# EAGLE design Shield (EAGLE 7.7.0)
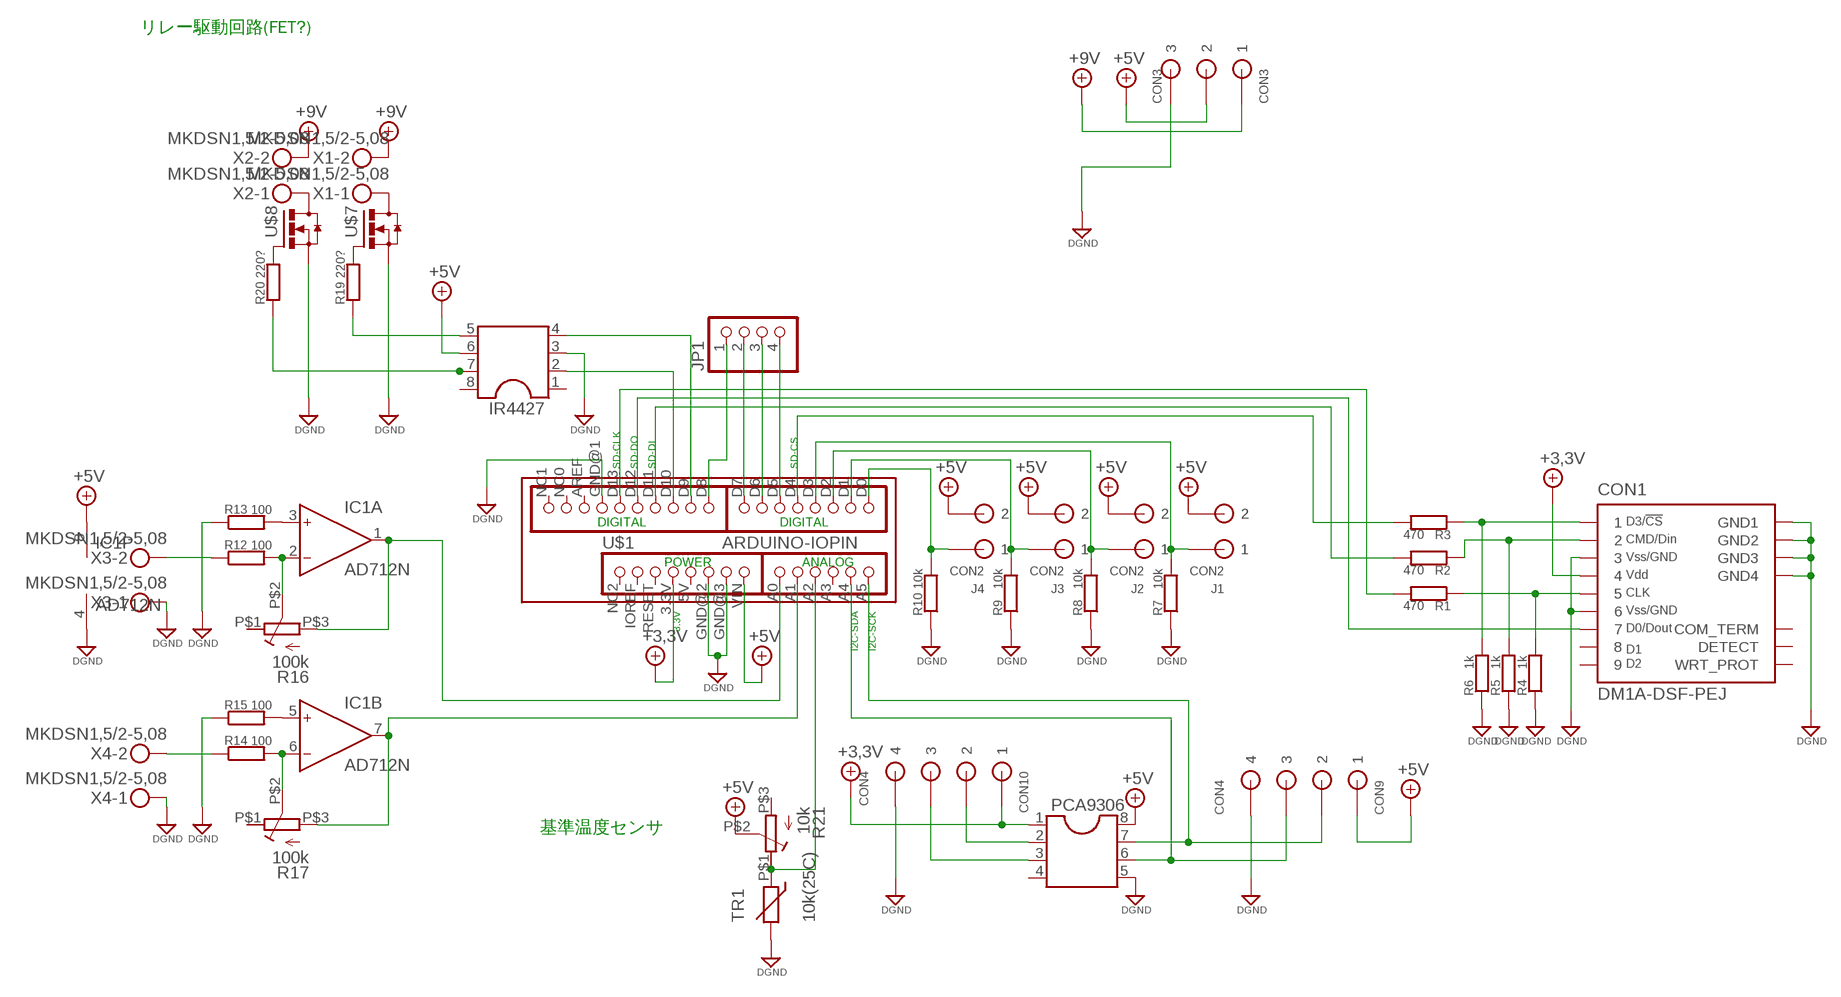
[diagram p0: schematic, sheet 1]

## Parts
CON1  DM1A-DSF-PEJ  [DM1A-DSF-PEJ]
CON3  CON3  [CON3]
CON9  CON4  [CON4]
CON10  CON4  [CON4]
IC1  AD712N  [DIL08]
IR4427  DIL8  [DIL08]
J1  CON2  [CON2]
J2  CON2  [CON2]
J3  CON2  [CON2]
J4  CON2  [CON2]
JP1  PINHD-1X4  [1X04]
PCA9306  DIL8S  [SOCKET-08]
R1  470  抵抗0207/7  [1/4W-H3_(0207/7)]
R2  470  抵抗0207/7  [1/4W-H3_(0207/7)]
R3  470  抵抗0207/7  [1/4W-H3_(0207/7)]
R4  1k  抵抗0207/7  [1/4W-H3_(0207/7)]
R5  1k  抵抗0207/7  [1/4W-H3_(0207/7)]
R6  1k  抵抗0207/7  [1/4W-H3_(0207/7)]
R7  10k  抵抗0207/7  [1/4W-H3_(0207/7)]
R8  10k  抵抗0207/7  [1/4W-H3_(0207/7)]
R9  10k  抵抗0207/7  [1/4W-H3_(0207/7)]
R10  10k  抵抗0207/10  [1/4W-H4_(0207/10)]
R12  100  抵抗0207/7  [1/4W-H3_(0207/7)]
R13  100  抵抗0207/7  [1/4W-H3_(0207/7)]
R14  100  抵抗0207/7  [1/4W-H3_(0207/7)]
R15  100  抵抗0207/7  [1/4W-H3_(0207/7)]
R16  100k  抵抗(可変)  [GF063PB]
R17  100k  抵抗(可変)  [GF063PB]
R19  220?  抵抗0207/7  [1/4W-H3_(0207/7)]
R20  220?  抵抗0207/7  [1/4W-H3_(0207/7)]
R21  10k  抵抗(可変)  [GF063PB]
TR1  10k(25C)  THERMISTOR_R-2,5  [RS-2,5]
U$1  ARDUINO-IOPIN  [ARDUINO-SHIELD-PIN-ONLY]
U$7  TO-220(MOS-FET_N)  [TO-220]
U$8  TO-220(MOS-FET_N)  [TO-220]
X1  MKDSN1,5/2-5,08  [MKDSN1,5/2-5,08]
X2  MKDSN1,5/2-5,08  [MKDSN1,5/2-5,08]
X3  MKDSN1,5/2-5,08  [MKDSN1,5/2-5,08]
X4  MKDSN1,5/2-5,08  [MKDSN1,5/2-5,08]

## Nets
+3.3V: CON1.4 CON10.P$1 PCA9306.1 U$1.3.3V(3,3V) ; supply symbol labelled +3,3V
+5V: CON3.P$2 CON9.P$1 IC1.8(P:V+) IR4427.6 J1.P$2 J2.P$2 J3.P$2 J4.P$2 PCA9306.8 R21.P$2(S) U$1.VIN
+9V: CON3.P$1 X1.2 X2.2
DGND: CON1.3 CON1.6 CON1.GND1 CON1.GND2 CON1.GND3 CON1.GND4 CON3.P$3 CON9.P$4 CON10.P$4 IC1.4(P:V-) IR4427.3 PCA9306.5 R4.1 R5.1 R6.1 R7.1 R8.1 R9.1 R10.1 R13.1 R15.1 TR1.2 U$1.GND@1(GND0) U$1.GND@2(GND1) U$1.GND@3(GND2) U$7.3(S) U$8.3(S) X3.1 X4.1
N$1: CON1.2 R2.1 R5.2
N$2: R1.2 U$1.D13
N$3: CON1.5 R1.1 R4.2
N$4: J1.P$1 R7.2 U$1.D3
N$5: R2.2 U$1.D11
N$6: CON1.1 R3.1 R6.2
N$7: R3.2 U$1.D4
N$8: J2.P$1 R8.2 U$1.D2
N$9: CON1.7 U$1.D12
N$10: J3.P$1 R9.2 U$1.D1
N$11: J4.P$1 R10.2 U$1.D0
N$12: CON10.P$2 PCA9306.2
N$13: CON9.P$3 PCA9306.6 U$1.A4
N$14: CON9.P$2 PCA9306.7 U$1.A5
N$15: CON10.P$3 PCA9306.3
N$16: IC1.2(A:IN-) R12.2 R16.P$2(S)
N$17: IC1.3(A:IN+) R13.2
N$18: IC1.5(B:IN+) R15.2
N$19: IC1.6(B:IN-) R14.2 R17.P$2(S)
N$20: IC1.1(A:OUT) R16.P$3(A) U$1.A0
N$21: IC1.7(B:OUT) R17.P$3(A) U$1.A1
N$22: JP1.4 U$1.D5
N$23: JP1.3 U$1.D6
N$24: JP1.2 U$1.D7
N$25: JP1.1 U$1.D8
N$26: U$7.2(D) X1.1
N$27: R19.2 U$7.1(G)
N$28: R21.P$1(E) TR1.1 U$1.A2
N$29: IR4427.2 U$1.D10
N$30: IR4427.4 U$1.D9
N$31: U$8.2(D) X2.1
N$32: R20.2 U$8.1(G)
N$33: IR4427.5 R19.1
N$34: IR4427.7 R20.1
N$35: R14.1 X4.2
N$36: R12.1 X3.2
Unconnected: CON1.8 CON1.9 CON1.COM_TERM CON1.DETECT CON1.WRT_PROT IR4427.1 IR4427.8 PCA9306.4 R16.P$1(E) R17.P$1(E) R21.P$3(A) U$1.5V U$1.A3 U$1.AREF U$1.IOREF U$1.NC0 U$1.NC1 U$1.NC2 U$1.RESET

## Notes on the sheet
- リレー駆動回路(FET?)
- SD-CLK | SD-DO | SD-DI | SD-CS
- 3.3V | I2C-SDA | I2C-SCK
- 基準温度センサ

## Library data of the parts
CON1 = (スロット)SDカード:DM1A-DSF-PEJ: HIROSE DM1A
CON3 = (コネクタ)XH:CON3: low insertion CON
CON9 CON10 = (コネクタ)XH:CON4: Low insertion connector 4pin
IC1 = analog-devices:AD712: Dual Precision, Low Cost, High Speed BiFET Op Amp Source: http://www.analog.com/static/imported-files/data_sheets/AD712.pdf; MF: ALTERA CORPORATION; MPN: AD712JNZ; OC_FARNELL: 9604898; OC_NEWARK: 59K4554
IR4427 PCA9306 = (半導体)汎用DIP:DIL8: Dual In Line / Socket
J1-J4 = (コネクタ)XH:CON2: low insertion CON
JP1 = (コネクタ)ピンヘッダ:PINHD-1X4: PIN HEADER
R1-R10 R12-R15 R19 R20 = (Foundation)抵抗:抵抗: RESISTOR, European symbol
R16 R17 R21 = (抵抗)可変抵抗:抵抗(可変): Trimm resistor
TR1 = discrete:THERMISTOR_: Thermo Resistor
U$1 = (モジュール)Arduino:ARDUINO-IOPIN
U$7 U$8 = (半導体)FET＆トランジスタ:TO-220(MOS-FET_N)
X1-X4 = con-phoenix-508:MKDSN1,5/2-5,08: MKDSN 1,5/ 2-5,08 Printklemme Nennstrom: 13,5 A Nennspannung: 250 V Rastermaß: 5,08 mm Polzahl: 2 Anschlussart: Schraubanschluss Montage: Löten Anschlussrichtung Leiter/Platine: 0 ° Artikelnummer: 1729128 Source: http://eshop.phoenixcontact.com .. 1729128.pdf

## Board
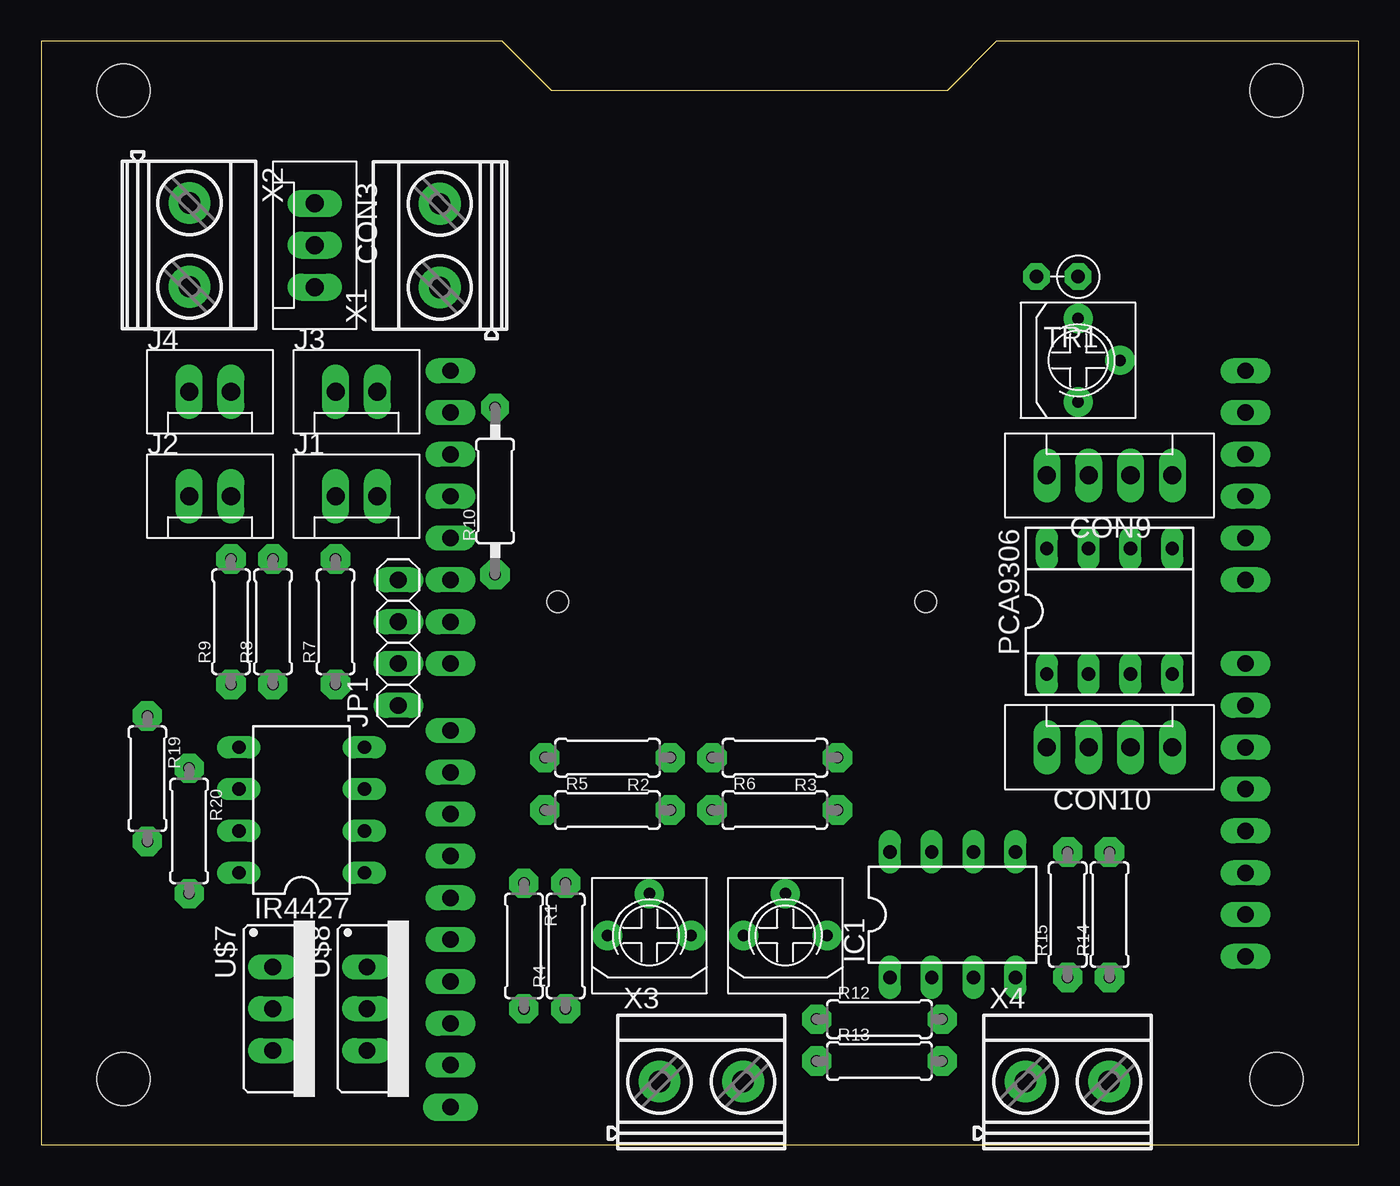
[diagram p1: board, top side]
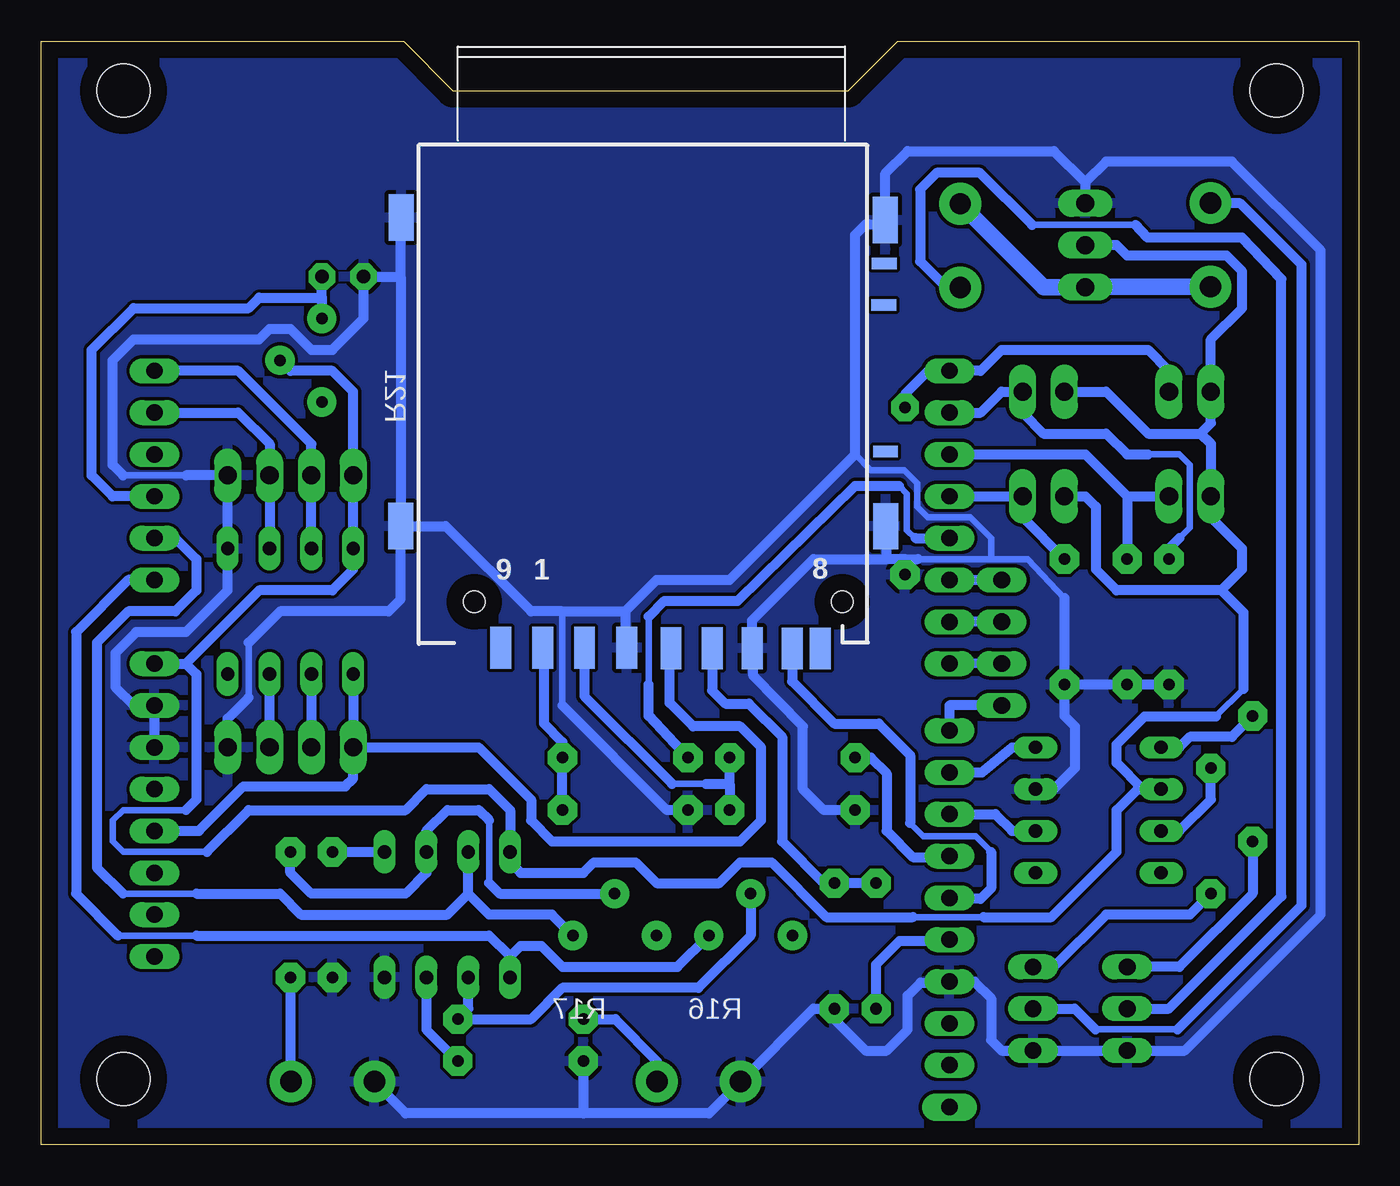
[diagram p2: board, bottom side, seen from below]

Size 80 x 67 mm. Coordinates in mm from the lower left corner, seen from the top.
Outline: 0,0 80,0 80,67 58,67 55,64 31,64 28,67 0,67 0,0
Copper layers (1*16): Top 0.035mm / dielectric 1.5mm / Bottom 0.035mm
Design rules "default": minimum track width 10mil, minimum drill 24mil, track to track 8mil, track to pad 8mil, pad to pad 8mil, via to via 8mil, smd to smd 8mil, copper to edge 40mil, drill to drill 8mil, minimum pad ring 10mil, minimum via ring 8mil, stop-mask expansion 4mil, vias tented up to drill 0mil, thermal gap 10mil
Holes 3.2 mm at 5,4 5,64 75,64 75,4

### Footprints (pad centres in the part's own frame; a part is rotated, then mirrored left to right if it is on the bottom)
DM1A-DSF-PEJ = smd 1.27 x 2.54: 1 6.263,16.809; 2 3.738,16.809; 3 1.161,16.813; 4 -1.516,16.84; 5 -4.016,16.84; 6 -6.44,16.84; 7 -8.865,16.866; 8 -10.565,16.866; 9 8.814,16.809 | smd 1.5 x 0.7: COM_TERM -14.462,-6.502; DETECT -14.532,4.902; WRT_PROT -14.437,-3.988 | smd 1.5 x 2.8: GND1 14.895,9.427; GND2 -14.549,9.452; GND3 -14.523,-9.152; GND4 14.859,-9.305 | hole 1.295: -11.913,14.021; 10.439,14.021
CON3 = drill 1.1 long: P$1 2.54,0; P$2 0,0; P$3 -2.54,0
CON4 = drill 1.1 long: P$1 3.81,0; P$2 1.27,0; P$3 -1.27,0; P$4 -3.81,0
DIL08 = drill 0.813 long: 1 -3.81,-3.81; 2 -1.27,-3.81; 3 1.27,-3.81; 4 3.81,-3.81; 5 3.81,3.81; 6 1.27,3.81; 7 -1.27,3.81; 8 -3.81,3.81
CON2 = drill 1.1 long: P$1 1.27,0; P$2 -1.27,0
1X04 = drill 1.016 long: 1 -3.81,0; 2 -1.27,0; 3 1.27,0; 4 3.81,0
SOCKET-08 = drill 0.813 long: 1 -3.81,-3.81; 2 -1.27,-3.81; 3 1.27,-3.81; 4 3.81,-3.81; 5 3.81,3.81; 6 1.27,3.81; 7 -1.27,3.81; 8 -3.81,3.81
1/4W-H3_(0207/7) = drill 0.7 pad 1.778 octagon: 1 -3.81,0; 2 3.81,0
1/4W-H4_(0207/10) = drill 0.7 pad 1.778 octagon: 1 -5.08,0 | drill 0.7 pad 1.676 octagon: 2 5.08,0
GF063PB = drill 0.7 pad 1.778: P$1 0,2.54; P$2 2.54,0; P$3 0,-2.54
RS-2,5 = drill 0.813 pad 1.6 octagon: 1 -1.27,0; 2 1.27,0
ARDUINO-SHIELD-PIN-ONLY = drill 1 long: 3.3V 2.54,-23.495; 5V 5.08,-23.495; A0 17.78,-23.495; A1 20.32,-23.495; A2 22.86,-23.495; A3 25.4,-23.495; A4 27.94,-23.495; A5 30.48,-23.495; AREF -9.144,24.765; D0 30.48,24.765; D1 27.94,24.765; D2 25.4,24.765; D3 22.86,24.765; D4 20.32,24.765; D5 17.78,24.765; D6 15.24,24.765; D7 12.7,24.765; D8 8.636,24.765; D9 6.096,24.765; D10 3.556,24.765; D11 1.016,24.765; D12 -1.524,24.765; D13 -4.064,24.765; GND@1 -6.604,24.765; GND@2 7.62,-23.495; GND@3 10.16,-23.495; IOREF -2.54,-23.495; NC0 -11.684,24.765; NC2 -5.08,-23.495; RESET 0,-23.495; VIN 12.7,-23.495 | drill 1 pad 1.676 long: NC1 -14.224,24.765
TO-220 = drill 1.016 long: 1 -2.54,0; 2 0,0; 3 2.54,0
MKDSN1,5/2-5,08 = drill 1.3 pad 2.54: 1 -2.561,0.025; 2 2.519,0.025

### Placement (x,y rotation side)
CON1  43.27,46.99 180 bottom
CON3  16.61,54.61 270 top
CON9  64.86,40.64 180 top
CON10  64.86,24.13 180 top
IC1  55.34,13.97 0 top
IR4427  15.81,20.32 90 top
J1  19.14,39.37 0 top
J2  10.26,39.37 0 top
J3  19.14,45.72 0 top
J4  10.26,45.72 0 top
JP1  21.68,30.48 90 top
PCA9306  64.86,32.38 0 top
R1  29.3,12.06 270 top
R2  34.38,23.5 180 top
R3  44.55,23.5 180 top
R4  31.84,12.06 90 top
R5  34.38,20.32 0 top
R6  44.55,20.32 0 top
R7  17.88,31.75 90 top
R8  14.06,31.75 90 top
R9  11.53,31.75 90 top
R10  27.56,39.69 90 top
R12  50.9,7.62 0 top
R13  50.9,5.08 0 top
R14  64.86,13.97 90 top
R15  62.33,13.97 90 top
R16  36.92,12.7 90 top
R17  45.18,12.7 90 top
R19  6.45,22.23 270 top
R20  8.98,19.05 270 top
R21  62.96,47.62 0 top
TR1  61.69,52.7 180 top
U$1  49.62,16.51 90 top
U$7  14.06,8.26 270 top
U$8  19.78,8.26 270 top
X1  24.23,54.61 90 top
X2  8.98,54.61 270 top
X3  40.1,3.81 0 top
X4  62.33,3.81 0 top

### Tracks (layer width: path | path; a pad name or v marks a point on that pad's centre or on a via)
+3.3V
  Bottom 0.61: U$1.3.3V 70.42,19.05 67.72,21.75 61.53,21.75 61.05,22.23 CON10.P$1 | PCA9306.1 CON10.P$1 | CON10.P$1 53.44,24.13 50.26,20.95 50.26,19.68 48.99,18.41 37.56,18.41 36.29,19.68 36.29,24.13 37.56,25.4 40.42,25.4 41.85,26.83 41.85,30.06 CON1.4
+5V
  Bottom 0.406: 71.22,20.32 75.03,20.32 75.66,19.68 75.66,18.41 75.03,17.78 69.94,17.78 | 27.08,13.81 22.8,13.81 | 8.68,26 7,27.68
  Bottom 0.61: U$1.VIN 71.22,29.21 | 71.22,29.21 66.77,33.66 62.33,33.66 61.05,34.92 PCA9306.8 CON9.P$1 61.05,45.72 62.33,46.99 64.86,46.99 R21.P$2 | 71.22,29.21 70.58,28.57 70.58,20.95 71.22,20.32 | 69.94,17.78 67.41,20.32 57.88,20.32 56.61,21.59 52.8,21.59 51.53,20.32 IC1.8 51.53,17.14 50.9,16.51 47.09,16.51 46.45,17.14 43.91,17.14 42.64,15.88 38.83,15.88 37.56,17.14 35.66,17.14 32.32,13.81 27.08,13.81 | 22.8,13.81 18.67,13.81 14.7,17.78 14.7,20.32 13.43,21.59 IR4427.6 13.11,21.59 14.7,23.18 14.7,24.3 13,26 8.68,26 | J3.P$2 15.34,45.72 12.79,43.18 9.62,43.18 | 9.62,43.18 8.98,43.81 J4.P$2 8.98,48.9 7.08,50.8 7.08,53.02 8.03,53.98 14.06,53.98 14.7,54.61 CON3.P$2 | 9.62,43.18 8.98,42.55 J2.P$2 8.98,38.1 7.08,36.2 7.08,34.92 8.35,33.66 | J1.P$2 16.61,39.37 15.97,38.73 15.97,34.92 14.7,33.66 8.35,33.66 | 7,27.68 7,32.3 8.35,33.66
+9V
  Bottom 1.016: X2.2 16.58,52.09 CON3.P$1 19.14,52.07 X1.2
DGND
  Bottom 0.406: 67.41,27.15 67.41,30.48 | 71.22,40.64 75.03,40.64 | 22.32,35.56 26.77,35.56 | 22.32,35.56 20.1,35.56 17.88,33.18 | 48.35,26.67 48.35,32.38 | 30.57,41.91 29.62,40.96 27.6,40.96 26.8,40.16 26.8,38.73 26.17,38.1 23.59,38.1 22.32,36.83 22.32,35.56
  Bottom 0.61: 47.09,1.91 39.44,1.91 X3.1 33.12,8.26 R4.1 31.84,7.62 29.94,5.71 28.67,5.71 27.4,6.99 27.4,9.05 26.61,9.84 24.92,9.84 U$1.GND@1 23.34,9.91 22.32,8.89 22.32,6.35 21.68,5.71 U$8.3 U$7.3 10.57,5.71 2.32,13.97 2.32,54.29 7.71,59.69 15.34,59.69 16.61,58.42 | 47.09,1.91 57.88,1.91 59.78,3.83 X4.1 | R13.1 47.09,1.91 | U$1.GND@2 U$1.GND@3 74.39,26.67 75.5,27.78 75.5,29.84 74.23,31.11 71.22,31.11 68.67,33.66 PCA9306.5 CON9.P$4 71.22,40.64 | CON10.P$4 68.67,25.88 67.41,27.15 | 67.41,30.48 65.5,32.38 58.9,32.38 58.17,33.12 CON1.GND1 | 75.03,40.64 75.66,41.27 75.66,47.62 74.39,48.9 66.77,48.9 66.14,49.53 64.86,49.53 63.59,48.26 62.33,48.26 60.42,50.16 TR1.2 58.17,52.7 | R5.1 32.48,20.32 33.75,21.59 33.75,25.4 36.77,28.47 CON1.6 36.84,31.84 33.12,35.56 28.67,35.56 | 28.67,35.56 28.67,37.48 CON1.GND2 | 58.17,52.7 CON1.GND1 | 58.17,52.7 58.17,56.26 CON1.GND4 | 27.56,35.56 28.67,35.56 | 27.56,35.56 26.77,35.56 | 17.88,33.18 R7.1 | R9.1 R8.1 R7.1 | R7.1 17.88,26.04 17.24,25.4 17.24,22.86 18.51,21.59 IR4427.3 | CON1.GND1 55.44,37.56 50.26,32.38 48.35,32.38 44.55,32.38 | 44.55,32.38 44.55,30.29 CON1.3 | 44.55,32.38 42.64,34.29 38.2,34.29 30.57,41.91 30.57,55.24 29.94,55.88 29.01,55.88 CON1.GND3 28.75,58.97 27.4,60.33 18.51,60.33 16.61,58.42 | 16.61,58.42 CON3.P$3 | R6.1 42.01,20.32 48.35,26.67 | R10.1 27.56,35.56
  pour Bottom: 0,67 80,67 80,0 0,0
N$1
  Bottom 0.406: 41.69,21.91 39.62,21.91
  Bottom 0.61: 38.2,21.91 R5.2 | 38.2,21.91 R2.1 | CON1.2 47.01,27.23 41.69,21.91 | 39.62,21.91 38.2,21.91
N$2
  Bottom 0.61: R1.2 29.3,10.95 27.88,12.38 24.92,12.38 U$1.D13
N$3
  Bottom 0.61: CON1.5 39.26,27.57 38.47,26.78 37.04,26.78 35.02,24.77 35.02,18.41 32.48,15.88 R4.2 R1.1
N$4
  Bottom 0.61: U$1.D3 J1.P$1 20.41,38.1 R7.2
N$5
  Bottom 0.61: R2.2 29.62,23.5 28.67,22.54 28.67,19.05 27.08,17.46 24.92,17.46 U$1.D11
N$6
  Bottom 0.61: R6.2 R3.1 48.35,24.45 49.47,25.56 49.47,28.66 CON1.1
N$7
  Bottom 0.406: 43.12,27.94 43.12,32.07 | 27.92,40.01 27.44,39.53 27.44,37.31 26.92,36.83
  Bottom 0.61: R3.2 43.12,26.04 43.12,27.94 | 43.12,32.07 42.16,33.02 37.72,33.02 30.57,40.01 27.92,40.01 | 26.92,36.83 U$1.D4
N$8
  Bottom 0.61: U$1.D2 16.61,41.91 14.06,39.37 | 14.06,39.37 J2.P$1 | 14.06,39.37 R8.2
N$9
  Bottom 0.406: 27.24,19.53 26.45,18.73 23.27,18.73 22.32,17.78
  Bottom 0.61: CON1.7 34.41,28.12 31.84,25.56 29.15,25.56 27.24,23.65 27.24,19.53 | 22.32,17.78 22.32,15.56 22.95,14.92 24.8,14.92 U$1.D12
N$10
  Bottom 0.406: 12.79,41.91 10.89,41.91 10.26,41.27 10.26,37.47 10.89,36.83
  Bottom 0.61: U$1.D1 22.95,44.45 21.68,45.72 J3.P$1 20.41,44.45 19.14,43.18 15.34,43.18 14.06,41.91 12.79,41.91 | 10.89,36.83 11.53,36.2 R9.2
N$11
  Bottom 0.61: J4.P$1 11.53,46.99 12.79,48.26 21.68,48.26 22.95,46.99 U$1.D0 26.13,46.99 27.56,45.56 R10.2
N$12
  Bottom 0.61: PCA9306.2 CON10.P$2
N$13
  Bottom 0.61: PCA9306.6 CON9.P$3 66.14,42.55 68.04,44.45 U$1.A4
N$14
  Bottom 0.61: PCA9306.7 CON9.P$2 63.59,42.55 68.04,46.99 U$1.A5
N$15
  Bottom 0.61: CON10.P$3 PCA9306.3
N$16
  Bottom 0.61: IC1.2 54.07,8.26 R12.2 50.26,7.62 48.35,9.53 40.1,9.53 36.92,12.7 R16.P$2
N$17
  Bottom 0.61: IC1.3 56.61,6.99 R13.2
N$18
  Bottom 0.61: R15.2 IC1.5
N$19
  Bottom 0.406: 52.8,19.68 52.8,15.88
  Bottom 0.61: R14.2 64.86,16.51 63.59,15.24 57.88,15.24 56.61,16.51 IC1.6 56.61,19.05 55.34,20.32 53.44,20.32 52.8,19.68 | 52.8,15.88 52.16,15.24 R17.P$2
N$20
  Bottom 0.406: 75.34,12.7 70.58,12.7
  Bottom 0.61: U$1.A0 74.71,34.29 77.88,31.11 77.88,15.24 75.34,12.7 | 70.58,12.7 52.8,12.7 51.53,11.43 | IC1.1 51.53,11.43 | 51.53,11.43 50.9,12.06 49.62,12.06 48.35,10.79 41.37,10.79 R16.P$3
N$21
  Bottom 0.406: 75.03,15.24 70.58,15.24
  Bottom 0.61: U$1.A1 71.85,36.83 70.58,35.56 70.58,33.66 71.85,32.38 74.71,32.38 76.61,30.48 76.61,16.83 75.03,15.24 | 70.58,15.24 65.5,15.24 64.23,13.97 55.34,13.97 54.07,15.24 | 54.07,15.24 IC1.7 | R17.P$3 48.99,13.97 52.8,13.97 54.07,15.24
N$22
  Bottom 0.61: U$1.D5 JP1.4
N$23
  Bottom 0.61: JP1.3 U$1.D6
N$24
  Bottom 0.254: 24.96,29.26 U$1.D7
  Bottom 0.61: 24.96,29.26 23.59,29.26 JP1.2
N$25
  Bottom 0.61: JP1.1 24.86,26.67 U$1.D8
N$26
  Bottom 0.406: 13.57,55.84 19.84,55.84
  Bottom 0.61: U$7.2 11.53,8.26 4.7,15.08 4.7,52.55 7.1,55.08 12.83,55.08 13.57,55.84 | 19.84,55.84 23,59 25.64,59 26.64,58 26.64,53.63 25,52 24.25,52 X1.1
N$27
  Bottom 0.61: R19.2 6.45,15.24 10.89,10.79 U$7.1
N$28
  Bottom 0.61: U$1.A2 75.66,39.37 76.93,40.64 76.93,48.26 74.39,50.8 67.41,50.8 66.77,51.44 62.96,51.44 | 62.96,51.44 TR1.1 | 62.96,51.44 R21.P$1
N$29
  Bottom 0.61: U$1.D10 22.07,20.07 21.05,19.05 IR4427.2
N$30
  Bottom 0.61: U$1.D9 22.89,22.61 21.05,24.13 IR4427.4
N$31
  Bottom 0.406: 16,7 11,7
  Bottom 0.61: U$8.2 17.25,8.26 16,7 | 11,7 3.48,14.52 3.48,53.43 7.21,57.16 9,57.16 X2.1
N$32
  Bottom 0.61: R20.2 10.26,13.97 15.34,13.97 18.51,10.79 U$8.1
N$33
  Bottom 0.61: R19.1 7.71,24.77 10.26,24.77 10.89,24.13 IR4427.5
N$34
  Bottom 0.61: IR4427.7 10.89,19.05 8.98,20.95 R20.1
N$35
  Bottom 0.61: R14.1 64.86,5.76 X4.2
N$36
  Bottom 0.61: R12.1 45.13,7.62 42.64,5.08 42.62,5.06 X3.2